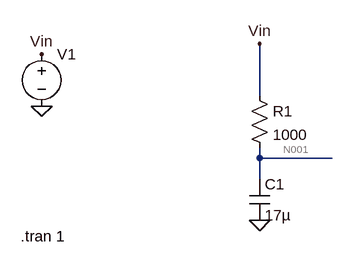
[diagram p0: schematic lowPassFilter.asc]
lowPassFilter.asc, the LTspice schematic file:
Version 4
SHEET 1 1120 680
WIRE 368 208 368 128
WIRE 368 304 368 288
WIRE 480 304 368 304
WIRE 368 336 368 304
FLAG 32 224 0
FLAG 32 144 Vin
FLAG 368 128 Vin
FLAG 368 400 0
SYMBOL voltage 32 128 R0
WINDOW 3 24 96 Invisible 2
WINDOW 123 0 0 Left 0
WINDOW 39 0 0 Left 0
SYMATTR Value PULSE(0 15 0 0.01m 0.01m 1m 2m)
SYMATTR InstName V1
SYMBOL res 352 192 R0
SYMATTR InstName R1
SYMATTR Value 1000
SYMBOL cap 352 336 R0
SYMATTR InstName C1
SYMATTR Value 17µ
TEXT 0 424 Left 2 !.tran 1

The netlist it stands for:
* lowPassFilter.asc
V1 Vin 0 PULSE(0 15 0 0.01m 0.01m 1m 2m)
R1 Vin N001 1000
C1 N001 0 17µ
.tran 1
.backanno
.end

* Results of the author's LTspice run, read from the files saved beside the schematic
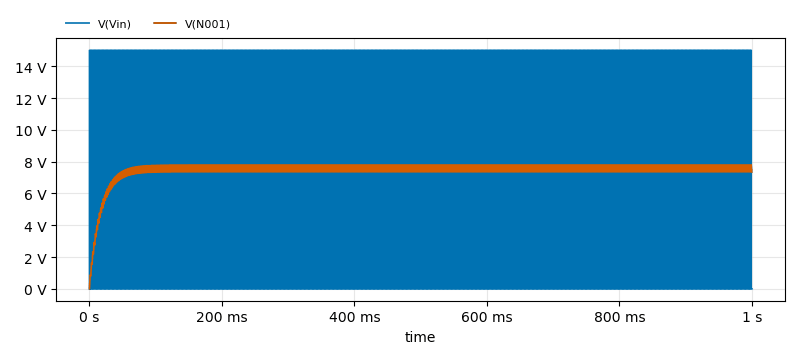
[diagram p1: Transient Analysis of lowPassFilter.asc, plotted from the saved traces]
* Transient Analysis, 1 run:
*   V(Vin): min 0 V, max 15 V, average 7.575 V, rms 10.66 V, last 0 V
*   V(N001): min 0 V, max 7.794 V, average 7.45 V, rms 7.483 V, last 7.357 V